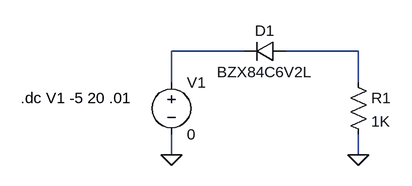
[diagram p0: schematic zener.asc]
zener.asc, the LTspice schematic file:
Version 4.1
SHEET 1 880 680
WIRE 128 128 16 128
WIRE 304 128 192 128
WIRE 16 176 16 128
WIRE 304 176 304 128
WIRE 16 288 16 256
WIRE 304 288 304 256
FLAG 16 288 0
FLAG 304 288 0
SYMBOL voltage 16 160 R0
WINDOW 123 0 0 Left 0
WINDOW 39 0 0 Left 0
SYMATTR InstName V1
SYMATTR Value 0
SYMBOL res 288 160 R0
SYMATTR InstName R1
SYMATTR Value 1K
SYMBOL diode 192 112 R90
WINDOW 0 0 32 VBottom 2
WINDOW 3 32 32 VTop 2
SYMATTR InstName D1
SYMATTR Value BZX84C6V2L
SYMATTR Description Diode
SYMATTR Type diode
TEXT -216 200 Left 2 !.dc V1 -5 20 .01

The netlist it stands for:
* zener.asc
V1 N001 0 0
R1 N002 0 1K
D1 N002 N001 BZX84C6V2L
.model D D
.lib standard.dio
.dc V1 -5 20 .01
.backanno
.end